# EAGLE schematic at89s52-mc-V0 (EAGLE 5.07)
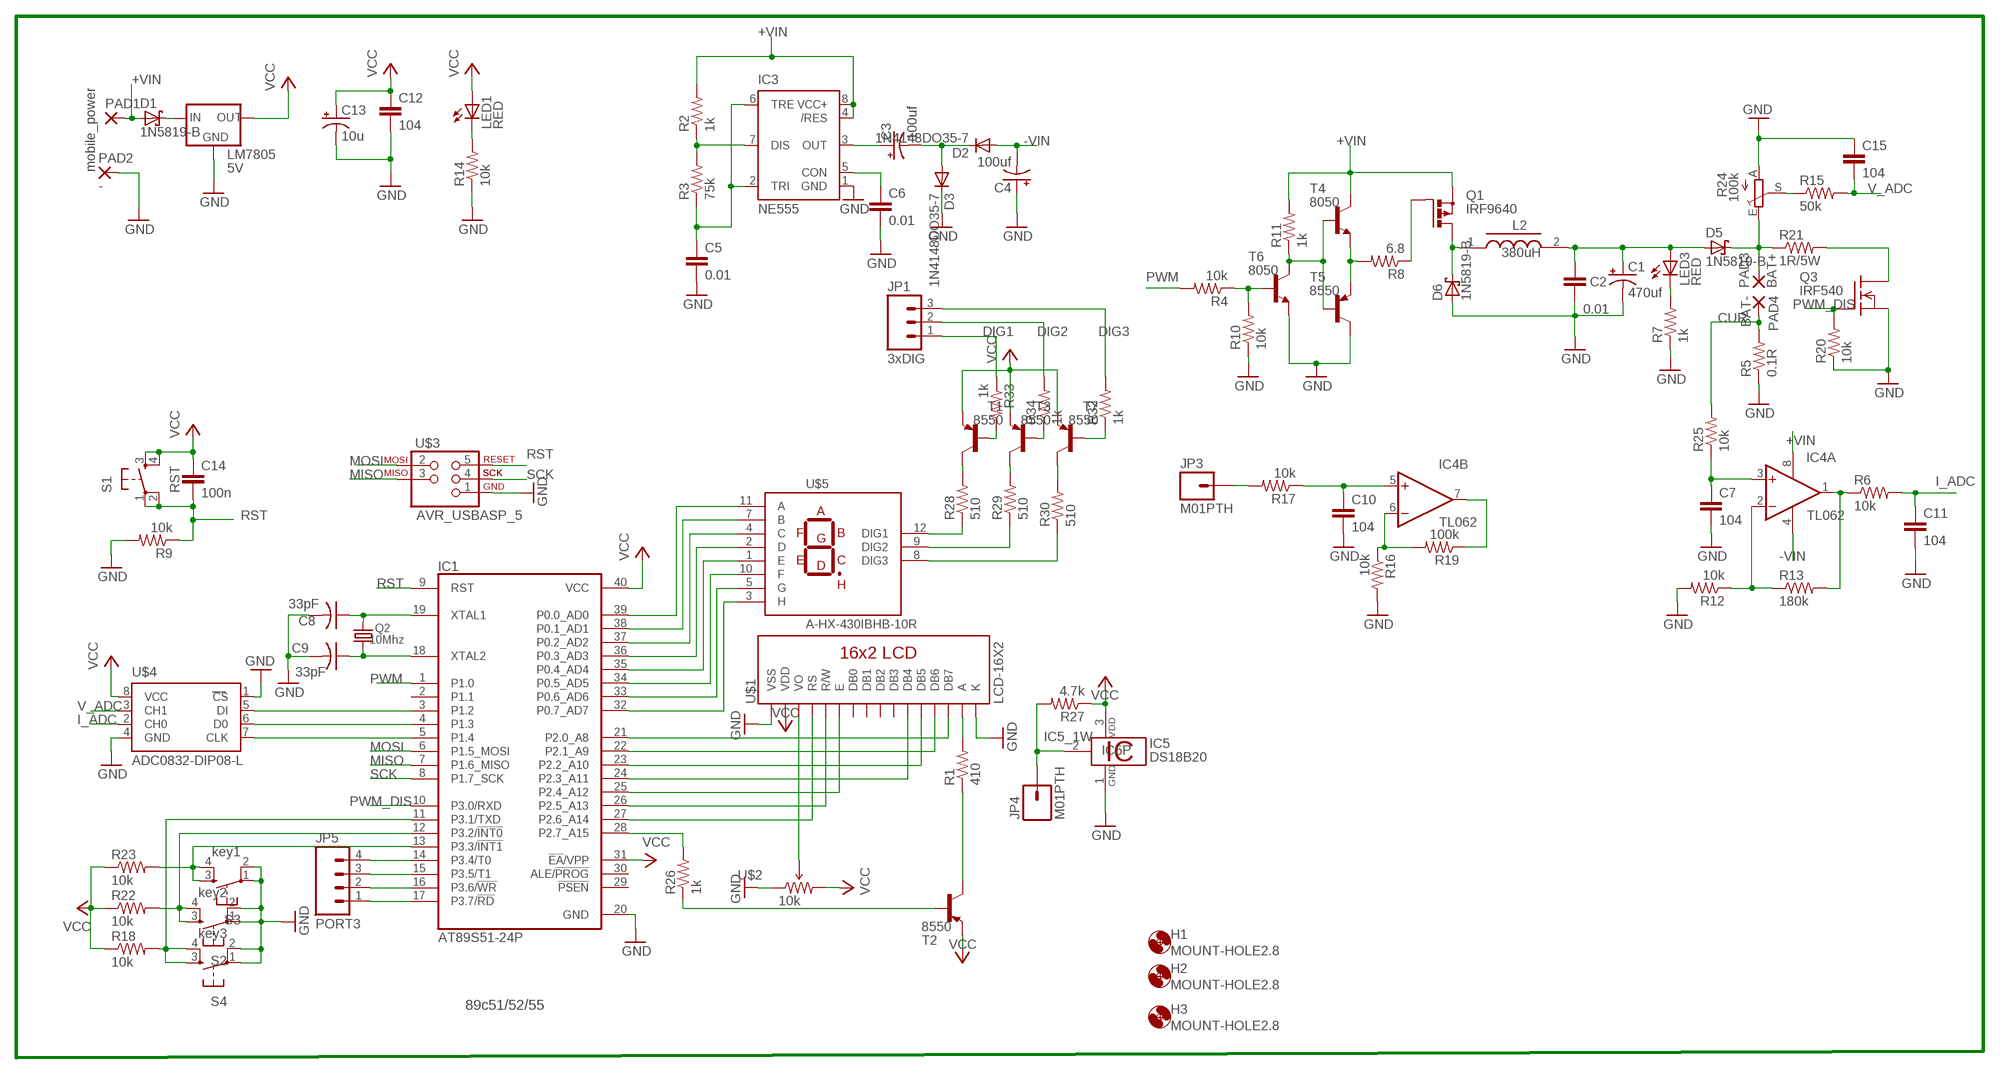
[diagram p0: schematic, sheet 1]

## Parts
C1  470uf  CAP_POLPTH1  [CPOL-RADIAL-100UF-25V]
C2  0.01  CAP0805  [0805]
C3  100uf  CAP_POLPTH1  [CPOL-RADIAL-100UF-25V]
C4  100uf  CAP_POLPTH1  [CPOL-RADIAL-100UF-25V]
C5  0.01  CAP0805  [0805]
C6  0.01  CAP0805  [0805]
C7  104  CAP0805  [0805]
C8  33pF  CAP-2,5  [C-2,5]
C9  33pF  CAP-2,5  [C-2,5]
C10  104  CAP0805  [0805]
C11  104  CAP0805  [0805]
C12  104  CAP0805  [0805]
C13  10u  CAP_POL1206  [EIA3216]
C14  100n  CAP0805  [0805]
C15  104  CAP0805  [0805]
D1  1N5819-B  [DO41-7.6]
D2  1N4148DO35-7  [DO35-7]
D3  1N4148DO35-7  [DO35-7]
D5  1N5819-B  [DO41-7.6]
D6  1N5819-B  [DO41-7.6]
H1  MOUNT-HOLE2.8  [2,8]
H2  MOUNT-HOLE2.8  [2,8]
H3  MOUNT-HOLE2.8  [2,8]
IC1  AT89S51-24P  [DIL40]
IC3  NE555  [DIL-08]
IC4  TL062  [DIP08-L]
IC5  DS18B20  [TO92-]
JP1  3xDIG  M03LOCK  [1X03_LOCK]
JP3  M01PTH  [1X01]
JP4  M01PTH  [1X01]
JP5  PORT3  M04LOCK_LONGPADS  [1X04_LOCK_LONGPADS]
L2  380uH  INDUCTOR-IED16  [ED16]
LED1  RED  LED3MM  [LED3MM]
LED3  RED  LED3MM  [LED3MM]
LM7805  5V  LM1117H  [78XXL]
PAD1  mobile_power  2,54/0,8  [2,54/0,8]
PAD2  -  2,54/0,8  [2,54/0,8]
PAD3  BAT+  2,54/1,1  [2,54/1,1]
PAD4  BAT-  2,54/1,1  [2,54/1,1]
Q1  IRF9640  PMOSFET_PTO220BH  [TO220BH]
Q2  10Mhz  HC18U-V  [HC18U-V]
Q3  IRF540  [TO220]
R1  410  RESISTOR1/4W  [AXIAL-0.3]
R2  1k  RESISTORPTH1  [AXIAL-0.3]
R3  75k  RESISTORPTH1  [AXIAL-0.3]
R4  10k  RESISTORPTH1  [AXIAL-0.3]
R5  0.1R  RESISTOR0414/15  [0414/15]
R6  10k  RESISTOR  [0805]
R7  1k  RESISTOR  [0805]
R8  6.8  RESISTORPTH1  [AXIAL-0.3]
R9  10k  RESISTOR0805  [0805]
R10  10k  RESISTORPTH1  [AXIAL-0.3]
R11  1k  RESISTORPTH1  [AXIAL-0.3]
R12  10k  RESISTOR  [0805]
R13  180k  RESISTOR  [0805]
R14  10k  RESISTOR0805  [0805]
R15  50k  RESISTOR  [0805]
R16  10k  RESISTOR  [0805]
R17  10k  RESISTOR  [0805]
R18  10k  RESISTOR1/4W  [AXIAL-0.3]
R19  100k  RESISTOR  [0805]
R20  10k  RESISTOR  [0805]
R21  1R/5W  RESISTOR0414/15  [0414/15]
R22  10k  RESISTOR1/4W  [AXIAL-0.3]
R23  10k  RESISTOR0805  [0805]
R24  100k  TRIM_EU-B64Y  [B64Y]
R25  10k  RESISTOR  [0805]
R26  1k  RESISTOR0805  [0805]
R27  4.7k  RESISTOR1/4W  [AXIAL-0.3]
R28  510  RESISTOR0805  [0805]
R29  510  RESISTOR0805  [0805]
R30  510  RESISTOR0805  [0805]
R32  1k  RESISTOR1/4W  [AXIAL-0.3]
R33  1k  RESISTOR1/4W  [AXIAL-0.3]
R34  1k  RESISTOR1/4W  [AXIAL-0.3]
S1  RST  TAC_SWITCHPTH  [TACTILE-PTH]
S2  key2  TAC_SWITCHPTH  [TACTILE-PTH]
S3  key1  TAC_SWITCHPTH  [TACTILE-PTH]
S4  key3  TAC_SWITCHPTH  [TACTILE-PTH]
T1  8550  -PNP-TO92-EBC  [TO92-EBC]
T2  8550  -PNP-TO92-EBC  [TO92-EBC]
T3  8550  -PNP-TO92-EBC  [TO92-EBC]
T4  8050  -NPN-TO92-EBC  [TO92-EBC]
T5  8550  -PNP-TO92-EBC  [TO92-EBC]
T6  8050  -NPN-TO92-EBC  [TO92-EBC]
T7  8550  -PNP-TO92-EBC  [TO92-EBC]
U$1  LCD-16X2  [LCD-16X2]
U$2  10k  TRIMPOTPTH  [TRIM_POT_PTH]
U$3  AVR_USBASP_5  [1X5]
U$4  ADC0832-DIP08-L  [DIP08-L]
U$5  A-HX-430IBHB-10R  [A-HX430-30MMX16MM]

## Nets
1W: IC5.2 JP4.1 R27.P$2
+VIN: D1.A IC3.4(/RES) IC3.8(VCC+) IC4.8(P:V+) PAD1.1(P) Q1.S R2.P$2 R11.P$2 T4.C
-VIN: C4.2(-) D2.A IC4.4(P:V-)
CUR: PAD4.1(P) R5.2 R25.2
DIG1: JP1.1 R33.P$1
DIG2: JP1.2 R34.P$2
DIG3: JP1.3 R32.P$2
GND: C1.2(-) C2.2 C4.1(+) C5.2 C6.2 C7.2 C8.2 C9.2 C10.2 C11.2 C12.2 C13.C(-) C15.1 D3.C D6.A IC1.20(GND) IC3.1(GND) IC5.1 LM7805.GND PAD2.1(P) Q3.3(S) R5.1 R7.1 R9.2 R10.P$1 R12.2 R14.1 R16.2 R20.1 R24.A S2.1 S2.2 S3.1 S3.2 S4.1 S4.2 T5.C T6.E U$1.1(VSS) U$1.16(K) U$2.1(CCW) U$3.1(GND) U$4.1(CS) U$4.4(GND)
I_ADC: C11.1 R6.2 U$4.2(CH0)
MISO: IC1.7(P1.6_MISO) U$3.3
MOSI: IC1.6(P1.5_MOSI) U$3.2
N$1: IC1.27(P2.6_A14) U$1.4(RS)
N$2: IC1.26(P2.5_A13) U$1.5(R/W)
N$3: IC1.25(P2.4_A12) U$1.6(E)
N$4: IC1.24(P2.3_A11) U$1.11(DB4)
N$5: IC1.23(P2.2_A10) U$1.12(DB5)
N$6: IC1.22(P2.1_A9) U$1.13(DB6)
N$7: IC1.21(P2.0_A8) U$1.14(DB7)
N$8: IC3.7(DIS) R2.P$1 R3.P$2
N$10: C5.1 IC3.2(TRI) IC3.6(TRE) R3.P$1
N$11: C6.1 IC3.5(CON)
N$12: C3.1(+) IC3.3(OUT)
N$13: C3.2(-) D2.C D3.A
N$14: C9.1 IC1.18(XTAL2) Q2.1
N$15: U$1.3(VO) U$2.2(WIPER)
N$16: R1.P$2 U$1.15(A)
N$17: LED1.K(C) R14.2
N$18: IC1.28(P2.7_A15) R26.2
N$19: R1.P$1 T2.C
N$20: IC4.7(B:OUT) R19.1
N$21: R4.P$1 R10.P$2 T6.B
N$22: R11.P$1 T4.B T5.B T6.C
N$23: R8.P$2 T4.E T5.E
N$24: LED3.K(C) R7.2
N$25: Q1.G R8.P$1
N$27: IC1.39(P0.0_AD0) U$5.11(A)
N$28: C1.1(+) C2.1 D5.A L2.2 LED3.A
N$29: D6.C L2.1 Q1.D
N$30: D5.C PAD3.1(P) R21.1 R24.E
N$31: IC4.2(A:-IN) R12.1 R13.1
N$32: IC4.1(A:OUT) R6.1 R13.2
N$33: D1.C LM7805.IN
N$34: C8.1 IC1.19(XTAL1) Q2.2
N$35: IC4.6(B:-IN) R16.1 R19.2
N$36: Q3.2(D) R21.2
N$37: IC1.3(P1.2) U$4.5(DI)
N$38: IC1.4(P1.3) U$4.6(D0)
N$39: IC1.5(P1.4) U$4.7(CLK)
N$40: IC1.13(P3.3/!INT1) R23.2 S3.3 S3.4
N$41: IC1.12(P3.2/!INT0) R22.P$2 S2.3 S2.4
N$42: IC1.11(P3.1/TXD) R18.P$2 S4.3 S4.4
N$43: IC1.14(P3.4/T0) JP5.4
N$44: IC1.15(P3.5/T1) JP5.3
N$45: IC1.16(P3.6/!WR) JP5.2
N$46: IC1.17(P3.7/!RD) JP5.1
N$47: IC1.38(P0.1_AD1) U$5.7(B)
N$48: IC1.37(P0.2_AD2) U$5.4(C)
N$49: IC1.36(P0.3_AD3) U$5.2(D)
N$50: IC1.35(P0.4_AD4) U$5.1(E)
N$51: IC1.34(P0.5_AD5) U$5.10(F)
N$52: C10.1 IC4.5(B:+IN) R17.1
N$53: R15.1 R24.S
N$54: C7.1 IC4.3(A:+IN) R25.1
N$55: R26.1 T2.B
N$56: JP3.1 R17.2
N$58: IC1.33(P0.6_AD6) U$5.5(G)
N$59: IC1.32(P0.7_AD7) U$5.3(H)
N$60: R32.P$1 T7.B
N$61: R28.2 T1.C
N$62: R29.2 T3.C
N$63: R30.2 T7.C
N$64: R34.P$1 T3.B
N$65: R33.P$2 T1.B
N$68: R28.1 U$5.12(DIG1)
N$69: R29.1 U$5.9(DIG2)
N$70: R30.1 U$5.8(DIG3)
PWM: IC1.1(P1.0) R4.P$2
PWM_DIS: IC1.10(P3.0/RXD) Q3.1(G) R20.2
RST: C14.2 IC1.9(RST) R9.1 S1.1 S1.2 U$3.5
SCK: IC1.8(P1.7_SCK) U$3.4
V_ADC: C15.2 R15.2 U$4.3(CH1)
VCC: C12.1 C13.A(+) C14.1 IC1.31(!EA!/VPP) IC1.40(VCC) IC5.3 LED1.A LM7805.OUT R18.P$1 R22.P$1 R23.1 R27.P$1 S1.3 S1.4 T1.E T2.E T3.E T7.E U$1.2(VDD) U$2.3(CW) U$4.8(VCC)
Unconnected: IC1.2(P1.1) IC1.29(!PSEN) IC1.30(ALE/!PROG) U$1.7(DB0) U$1.8(DB1) U$1.9(DB2) U$1.10(DB3)

## Notes on the sheet
- 89c51/52/55

## Library data of the parts
C1 C3 C4 C13 = SparkFun:CAP_POL: Capacitor Polarized These are standard SMD and PTH capacitors. Normally 10uF, 47uF, and 100uF in electrolytic and tantalum varieties. Always verify the external diameter of the through hole cap, it varies with capacity, voltage, and manufacturer. The EIA devices should be standard.
C2 C5-C7 C10-C12 C14 C15 = SparkFun:CAP: Capacitor Standard 0603 ceramic capacitor, and 0.1" leaded capacitor.
C8 C9 = DISCRETE:CAP-2,5
D1 D5 D6 = digital-toy:1N581*: 1.0A SCHOTTKY BARRIER RECTIFIER Source: http://www.diodes.com/datasheets/ds23001.pdf
D2 D3 = diode:1N4148: DIODE high speed (Philips)
H1-H3 = holes:MOUNT-HOLE: MOUNTING HOLE with drill center marker
IC1 = atmel:AT89S51-*: 8-bit Microcontroller with 4K BytesIn-System Programmable Flash Source: http://www.atmel.com/dyn/resources/prod_documents/doc2487.pdf
IC3 = st-microelectronics:NE555: General purpose bipolar Timer
IC4 = digital-toy:TL062: Linear Devices dual Operational amplifiers, JFET-Input Stage Input offset voltage:typical 3mV(25C)
IC5 = 1wire:DS18B20: Programmable Resolution Digital Thermometer This chip provides a onewire thermosensor with approx. 0.5°C accuracy. A programmable over/undertemperure alarm is available. The precision can be set from 9..12 bits. Notes: Vdd must be applied for accurate measurements at low temperatures, as the parasite power circuit otherwise heats the sensor. If parasite power is used, Vdd has to be connected to GND. The DS1822 is a low-cost thermometer chip, the DS18S20 is similar to the DS18B20, but with 9 Bit precision only. Author: Jan Kandziora <jjj@gmx.de>
JP1 = SparkFun:M03: Header 3 Standard 3-pin 0.1" header. Use with straight break away headers (SKU : PRT-00116), right angle break away headers (PRT-00553), swiss pins (PRT-00743), machine pins (PRT-00117), and female headers (PRT-00115). Molex polarized connector foot print use with SKU : PRT-08232 with associated crimp pins and housings.
JP3 JP4 = SparkFun:M01: Header 1 Standard 1-pin 0.1" header. Use with straight break away headers (SKU : PRT-00116), right angle break away headers (PRT-00553), swiss pins (PRT-00743), machine pins (PRT-00117), and female headers (PRT-00115).
JP5 = SparkFun:M04: Header 4 Standard 4-pin 0.1" header. Use with straight break away headers (SKU : PRT-00116), right angle break away headers (PRT-00553), swiss pins (PRT-00743), machine pins (PRT-00117), and female headers (PRT-00115). Molex polarized connector foot print use with SKU : PRT-08231 with associated crimp pins and housings.
L2 = digital-toy:INDUCTOR-I: Inductors with Iron
LED1 = LED:LED: LED OSRAM: - CHIPLED LG R971, LG N971, LY N971, LG Q971, LY Q971, LO R971, LY R971 LH N974, LH R974 LS Q976, LO Q976, LY Q976 LO Q996 - Hyper CHIPLED LW Q18S LB Q993, LB Q99A, LB R99A - SideLED LS A670, LO A670, LY A670, LG A670, LP A670 LB A673, LV A673, LT A673, LW A673 LH A674 LY A675 LS A676, LA A676, LO A676, LY A676, LW A676 LS A679, LY A679, LG A679 - Hyper Micro SIDELED® LS Y876, LA Y876, LO Y876, LY Y876 LT Y87S - SmartLED LW L88C, LW L88S LB L89C, LB L89S, LG L890 LS L89K, LO L89K, LY L89K LS L896, LA L896, LO L896, LY L896 - TOPLED LS T670, LO T670, LY T670, LG T670, LP T670 LSG T670, LSP T670, LSY T670, LOP T670, LYG T670 LG T671, LOG T671, LSG T671 LB T673, LV T673, LT T673, LW T673 LH T674 LS T676, LA T676, LO T676, LY T676, LB T676, LH T676, LSB T676, LW T676 LB T67C, LV T67C, LT T67C, LS T67K, LO T67K, LY T67K, LW E67C LS E67B, LA E67B, LO E67B, LY E67B, LB E67C, LV E67C, LT E67C LW T67C LS T679, LY T679, LG T679 LS T770, LO T770, LY T770, LG T770, LP T770 LB T773, LV T773, LT T773, LW T773 LH T774 LS E675, LA E675, LY E675, LS T675 LS T776, LA T776, LO T776, LY T776, LB T776 LHGB T686 LT T68C, LB T68C - Hyper Mini TOPLED® LB M676 - Mini TOPLED Santana® LG M470 LS M47K, LO M47K, LY M47K Source: http://www.osram.convergy.de LUXEON: - LUMILED® LXK2-PW12-R00, LXK2-PW12-S00, LXK2-PW14-U00, LXK2-PW14-V00 LXK2-PM12-R00, LXK2-PM12-S00, LXK2-PM14-U00 LXK2-PE12-Q00, LXK2-PE12-R00, LXK2-PE12-S00, LXK2-PE14-T00, LXK2-PE14-U00 LXK2-PB12-K00, LXK2-PB12-L00, LXK2-PB12-M00, LXK2-PB14-N00, LXK2-PB14-P00, LXK2-PB14-Q00 LXK2-PR12-L00, LXK2-PR12-M00, LXK2-PR14-Q00, LXK2-PR14-R00 LXK2-PD12-Q00, LXK2-PD12-R00, LXK2-PD12-S00 LXK2-PH12-R00, LXK2-PH12-S00 LXK2-PL12-P00, LXK2-PL12-Q00, LXK2-PL12-R00 Source: www.luxeon.com KINGBRIGHT: KA-3528ASYC Source: www.kingbright.com
LED3 = SparkFun:LED: LEDs Standard schematic elements and footprints for 5mm, 3mm, 1206, and 0603 sized LEDs. 5mm - Spark Fun Electronics SKU : COM-00529 (and others)
LM7805 = v-reg-2:LM1117
PAD1 PAD2 = wirepad:2,54/0,8: THROUGH-HOLE PAD
PAD3 PAD4 = wirepad:2,54/1,1: THROUGH-HOLE PAD
Q1 = transistor-power:PMOSFET_P: Power MOSFET P-Channel
Q2 = QUARTZ:HC18U-V
Q3 = transistor-fet:IRF540: N-Channel Enhancement MOSFET (HEXFET); 100V; 28A; 0,077Ohm
R1 R5 R9 R14 R18 R21-R23 R26-R30 R32-R34 = digital-toy:RESISTOR: Resistor Basic schematic elements and footprints for 0603, 1206, and PTH 1/10th watt (small) resistors.
R2-R4 R6-R8 R10-R13 R15-R17 R19 R20 R25 = SparkFun:RESISTOR: Resistor Basic schematic elements and footprints for 0603, 1206, and PTH 1/10th watt (small) resistors.
R24 = pot:TRIM_EU-: POTENTIOMETER
S1-S4 = digital-toy:TAC_SWITCH: Momentary Switch Button commonly used for reset or general input. Spark Fun Electronics SKU : COM-00097
T1-T3 T5 T7 = digital-toy:*-PNP-: PNP Transistror
T4 T6 = digital-toy:*-NPN-: NPN Transistror
U$1 = digital-toy:LCD-16X2
U$2 = SparkFun:TRIMPOT
U$3 = digital-toy:AVR_USBASP_5: USBasp minimal pin connector 1x4 pin no GND, does not stable. use this hyl <heyongli@gmail.com>
U$4 = digital-toy:ADC0832: National Semiconductor ADC 0832, 2 channel, 8bit.
U$5 = led-seg:A-HX-430IBHB-10R: Xuyang ShenZhen common anode 3 digit 7 segment led 30mmX16mm 7mm Hight (2.54mm pin) silk name: hx-430ibhb-10r by hyl, heyongli@gmail.com 2010-6-3